# EasyEDA Pro project ProProject_FPGA_oscilloscope Analog pre circuit PCB_2024-05-13.epro, schematic Schematic3
Create Date: 2024-05-12; Page Name: P1; Project Name: FPGA_oscilloscope Analog pre circuit PCB; Schematic Name: Schematic3; Update Date: 2024-05-13; Company: 嘉立创EDA; Page Size: A4; Version: V1.0
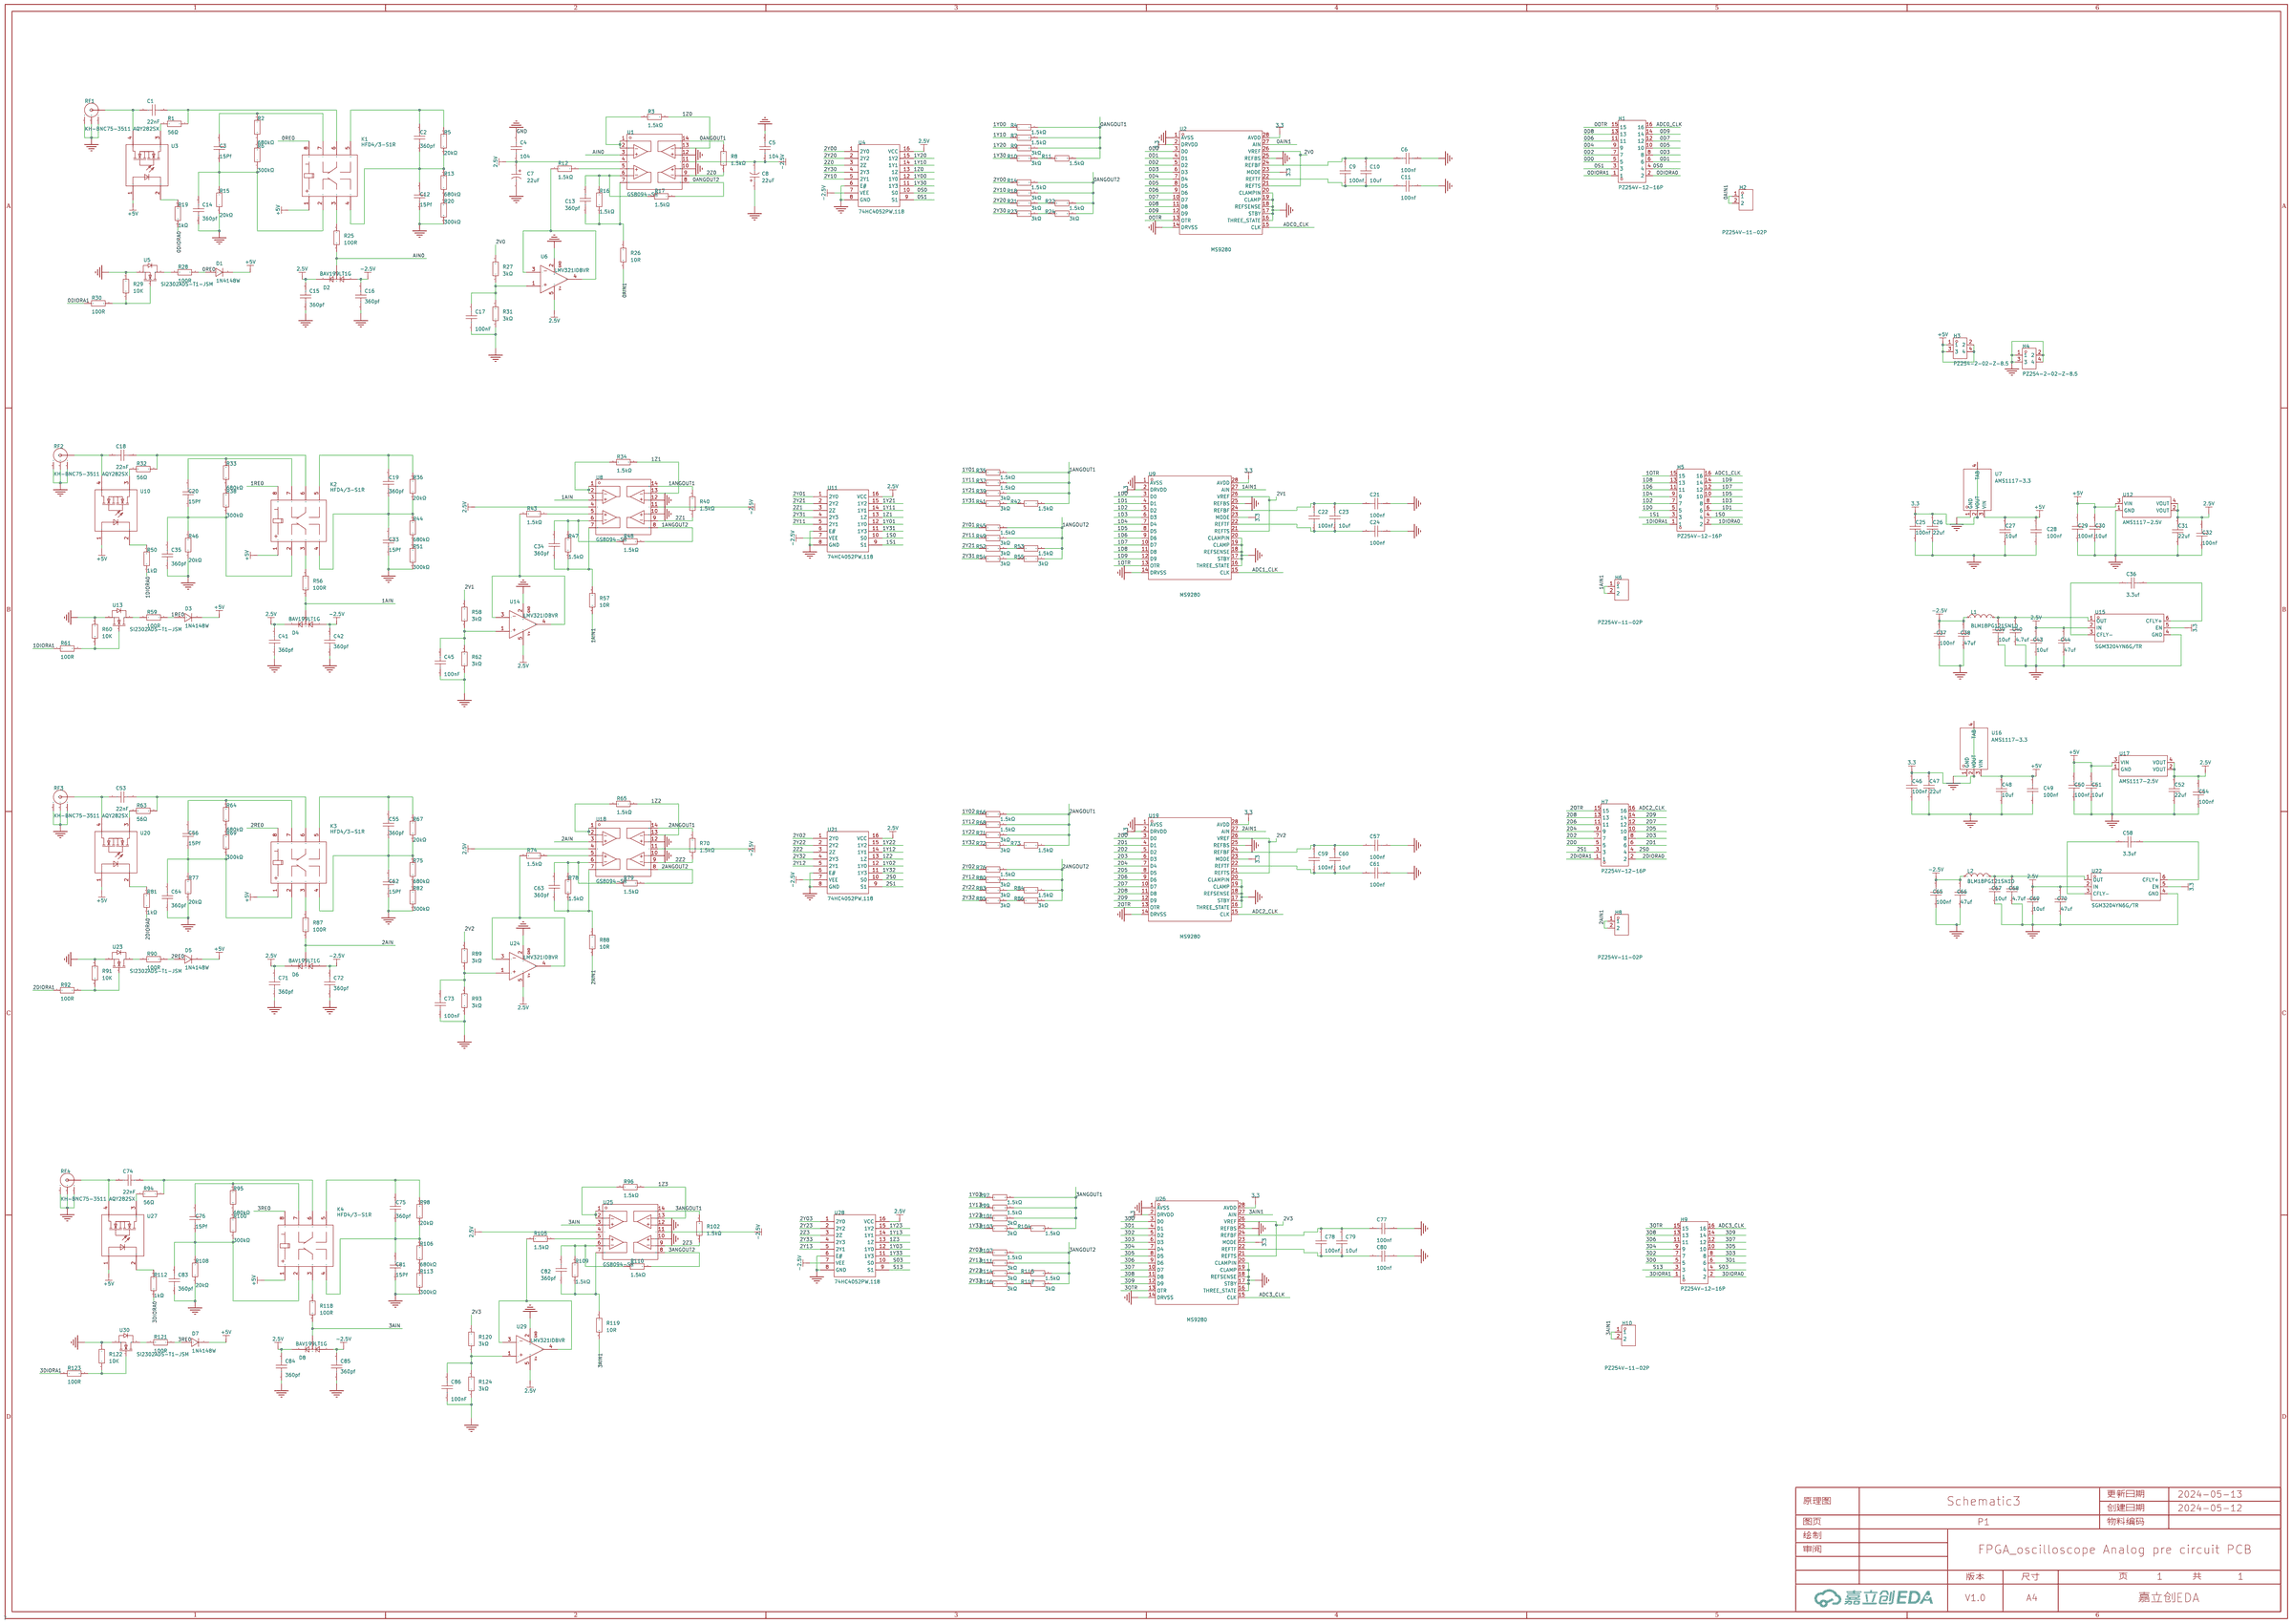
[diagram p0: schematic sheet]

## Parts
C1  22nF  [C0603]
C2  360pf  [C0603]
C3  15Pf  [C0603]
C4  104  [C0603]
C5  104  [C0603]
C6  100nf  [C0603]
C7  22uF  [CAP-SMD_BD4.0-L4.3-W4.3-FD-A]
C8  22uF  [CAP-SMD_BD4.0-L4.3-W4.3-FD-A]
C9  100nf  [C0603]
C10  10uf  [C0603]
C11  100nf  [C0603]
C12  15Pf  [C0603]
C13  360pf  [C0603]
C14  360pf  [C0603]
C15  360pf  [C0603]
C16  360pf  [C0603]
C17  100nF  [C0603]
C18  22nF  [C0603]
C19  360pf  [C0603]
C20  15Pf  [C0603]
C21  100nf  [C0603]
C22  100nf  [C0603]
C23  10uf  [C0603]
C24  100nf  [C0603]
C25  100nf  [C0603]
C26  22uf  [C0603]
C27  10uf  [C0603]
C28  100nf  [C0603]
C29  100nf  [C0603]
C30  10uf  [C0603]
C31  22uf  [C0603]
C32  100nf  [C0603]
C33  15Pf  [C0603]
C34  360pf  [C0603]
C35  360pf  [C0603]
C36  3.3uf  [C0603]
C37  100nf  [C0603]
C38  47uf  [C0603]
C39  10uf  [C0603]
C40  4.7uf  [C0603]
C41  360pf  [C0603]
C42  360pf  [C0603]
C43  10uf  [C0603]
C44  47uf  [C0603]
C45  100nF  [C0603]
C46  100nf  [C0603]
C47  22uf  [C0603]
C48  10uf  [C0603]
C49  100nf  [C0603]
C50  100nf  [C0603]
C51  10uf  [C0603]
C52  22uf  [C0603]
C53  22nF  [C0603]
C54  100nf  [C0603]
C55  360pf  [C0603]
C56  15Pf  [C0603]
C57  100nf  [C0603]
C58  3.3uf  [C0603]
C59  100nf  [C0603]
C60  10uf  [C0603]
C61  100nf  [C0603]
C62  15Pf  [C0603]
C63  360pf  [C0603]
C64  360pf  [C0603]
C65  100nf  [C0603]
C66  47uf  [C0603]
C67  10uf  [C0603]
C68  4.7uf  [C0603]
C69  10uf  [C0603]
C70  47uf  [C0603]
C71  360pf  [C0603]
C72  360pf  [C0603]
C73  100nF  [C0603]
C74  22nF  [C0603]
C75  360pf  [C0603]
C76  15Pf  [C0603]
C77  100nf  [C0603]
C78  100nf  [C0603]
C79  10uf  [C0603]
C80  100nf  [C0603]
C81  15Pf  [C0603]
C82  360pf  [C0603]
C83  360pf  [C0603]
C84  360pf  [C0603]
C85  360pf  [C0603]
C86  100nF  [C0603]
D1  1N4148W  [SOD-123_L2.8-W1.8-LS3.7-RD]
D2  BAV199LT1G  [SOT-23_L2.9-W1.3-P1.90-LS2.4-BR]
D3  1N4148W  [SOD-123_L2.8-W1.8-LS3.7-RD]
D4  BAV199LT1G  [SOT-23_L2.9-W1.3-P1.90-LS2.4-BR]
D5  1N4148W  [SOD-123_L2.8-W1.8-LS3.7-RD]
D6  BAV199LT1G  [SOT-23_L2.9-W1.3-P1.90-LS2.4-BR]
D7  1N4148W  [SOD-123_L2.8-W1.8-LS3.7-RD]
D8  BAV199LT1G  [SOT-23_L2.9-W1.3-P1.90-LS2.4-BR]
H1  PZ254V-12-16P  [HDR-TH_16P-P2.54-V-M-R2-C8-S2.54]
H2  PZ254V-11-02P  [HDR-TH_2P-P2.54-V-M]
H3  PZ254-2-02-Z-8.5  [HDR-TH_4P-P2.54-V-M-R2-C2-S2.54]
H4  PZ254-2-02-Z-8.5  [HDR-TH_4P-P2.54-V-M-R2-C2-S2.54]
H5  PZ254V-12-16P  [HDR-TH_16P-P2.54-V-M-R2-C8-S2.54]
H6  PZ254V-11-02P  [HDR-TH_2P-P2.54-V-M]
H7  PZ254V-12-16P  [HDR-TH_16P-P2.54-V-M-R2-C8-S2.54]
H8  PZ254V-11-02P  [HDR-TH_2P-P2.54-V-M]
H9  PZ254V-12-16P  [HDR-TH_16P-P2.54-V-M-R2-C8-S2.54]
H10  PZ254V-11-02P  [HDR-TH_2P-P2.54-V-M]
K1  HFD4/3-S1R  [RELAY-SMD_HFD4-3-S1R]
K2  HFD4/3-S1R  [RELAY-SMD_HFD4-3-S1R]
K3  HFD4/3-S1R  [RELAY-SMD_HFD4-3-S1R]
K4  HFD4/3-S1R  [RELAY-SMD_HFD4-3-S1R]
L1  BLM18PG121SN1D  [L0603]
L2  BLM18PG121SN1D  [L0603]
R1  56Ω  [R0603]
R2  680kΩ  [R0603]
R3  1.5kΩ  [R0603]
R4  1.5kΩ  [R0603]
R5  20kΩ  [R0603]
R6  300kΩ  [R0603]
R7  1.5kΩ  [R0603]
R8  1.5kΩ  [R0603]
R9  3kΩ  [R0603]
R10  3kΩ  [R0603]
R11  1.5kΩ  [R0603]
R12  1.5kΩ  [R0603]
R13  680kΩ  [R0603]
R14  1.5kΩ  [R0603]
R15  20kΩ  [R0603]
R16  1.5kΩ  [R0603]
R17  1.5kΩ  [R0603]
R18  3kΩ  [R0603]
R19  1kΩ  [R0603]
R20  300kΩ  [R0603]
R21  3kΩ  [R0603]
R22  1.5kΩ  [R0603]
R23  3kΩ  [R0603]
R24  3kΩ  [R0603]
R25  100R  [R0603]
R26  10R  [R0603]
R27  3kΩ  [R0603]
R28  100R  [R0603]
R29  10K  [R0603]
R30  100R  [R0603]
R31  3kΩ  [R0603]
R32  56Ω  [R0603]
R33  680kΩ  [R0603]
R34  1.5kΩ  [R0603]
R35  1.5kΩ  [R0603]
R36  20kΩ  [R0603]
R37  1.5kΩ  [R0603]
R38  300kΩ  [R0603]
R39  3kΩ  [R0603]
R40  1.5kΩ  [R0603]
R41  3kΩ  [R0603]
R42  1.5kΩ  [R0603]
R43  1.5kΩ  [R0603]
R44  680kΩ  [R0603]
R45  1.5kΩ  [R0603]
R46  20kΩ  [R0603]
R47  1.5kΩ  [R0603]
R48  1.5kΩ  [R0603]
R49  3kΩ  [R0603]
R50  1kΩ  [R0603]
R51  300kΩ  [R0603]
R52  3kΩ  [R0603]
R53  1.5kΩ  [R0603]
R54  3kΩ  [R0603]
R55  3kΩ  [R0603]
R56  100R  [R0603]
R57  10R  [R0603]
R58  3kΩ  [R0603]
R59  100R  [R0603]
R60  10K  [R0603]
R61  100R  [R0603]
R62  3kΩ  [R0603]
R63  56Ω  [R0603]
R64  680kΩ  [R0603]
R65  1.5kΩ  [R0603]
R66  1.5kΩ  [R0603]
R67  20kΩ  [R0603]
R68  1.5kΩ  [R0603]
R69  300kΩ  [R0603]
R70  1.5kΩ  [R0603]
R71  3kΩ  [R0603]
R72  3kΩ  [R0603]
R73  1.5kΩ  [R0603]
R74  1.5kΩ  [R0603]
R75  680kΩ  [R0603]
R76  1.5kΩ  [R0603]
R77  20kΩ  [R0603]
R78  1.5kΩ  [R0603]
R79  1.5kΩ  [R0603]
R80  3kΩ  [R0603]
R81  1kΩ  [R0603]
R82  300kΩ  [R0603]
R83  3kΩ  [R0603]
R84  1.5kΩ  [R0603]
R85  3kΩ  [R0603]
R86  3kΩ  [R0603]
R87  100R  [R0603]
R88  10R  [R0603]
R89  3kΩ  [R0603]
R90  100R  [R0603]
R91  10K  [R0603]
R92  100R  [R0603]
R93  3kΩ  [R0603]
R94  56Ω  [R0603]
R95  680kΩ  [R0603]
R96  1.5kΩ  [R0603]
R97  1.5kΩ  [R0603]
R98  20kΩ  [R0603]
R99  1.5kΩ  [R0603]
R100  300kΩ  [R0603]
R101  3kΩ  [R0603]
R102  1.5kΩ  [R0603]
R103  3kΩ  [R0603]
R104  1.5kΩ  [R0603]
R105  1.5kΩ  [R0603]
R106  680kΩ  [R0603]
R107  1.5kΩ  [R0603]
R108  20kΩ  [R0603]
R109  1.5kΩ  [R0603]
R110  1.5kΩ  [R0603]
R111  3kΩ  [R0603]
R112  1kΩ  [R0603]
R113  300kΩ  [R0603]
R114  3kΩ  [R0603]
R115  1.5kΩ  [R0603]
R116  3kΩ  [R0603]
R117  3kΩ  [R0603]
R118  100R  [R0603]
R119  10R  [R0603]
R120  3kΩ  [R0603]
R121  100R  [R0603]
R122  10K  [R0603]
R123  100R  [R0603]
R124  3kΩ  [R0603]
RF1  KH-BNC75-3511  [ANT-TH_KH-BNC75-3511]
RF2  KH-BNC75-3511  [ANT-TH_KH-BNC75-3511]
RF3  KH-BNC75-3511  [ANT-TH_KH-BNC75-3511]
RF4  KH-BNC75-3511  [ANT-TH_KH-BNC75-3511]
U1  GS8094-SR  [SOIC-14_L8.7-W3.9-P1.27-LS6.0-BL]
U2  MS9280  [SSOP-28_L10.2-W5.3-P0.65-LS7.8-BL]
U3  AQY282SX  [SOP-4_L4.3-W4.4-P2.54-LS7.0-BL]
U4  74HC4052PW,118  [TSSOP-16_L5.0-W4.4-P0.65-LS6.4-BL]
U5  SI2302ADS-T1-JSM  [SOT-23-3_L2.9-W1.3-P1.90-LS2.4-BR]
U6  LMV321IDBVR  [SOT-23-5_L3.0-W1.7-P0.95-LS2.8-BR]
U7  AMS1117-3.3  [SOT-223-3_L6.5-W3.5-P3.05-LS7.0]
U8  GS8094-SR  [SOIC-14_L8.7-W3.9-P1.27-LS6.0-BL]
U9  MS9280  [SSOP-28_L10.2-W5.3-P0.65-LS7.8-BL]
U10  AQY282SX  [SOP-4_L4.3-W4.4-P2.54-LS7.0-BL]
U11  74HC4052PW,118  [TSSOP-16_L5.0-W4.4-P0.65-LS6.4-BL]
U12  AMS1117-2.5V  [SOT-223_L6.5-W3.5-P2.30-LS7.0-BR]
U13  SI2302ADS-T1-JSM  [SOT-23-3_L2.9-W1.3-P1.90-LS2.4-BR]
U14  LMV321IDBVR  [SOT-23-5_L3.0-W1.7-P0.95-LS2.8-BR]
U15  SGM3204YN6G/TR  [SOT-23-6_L2.9-W1.6-P0.95-LS2.8-BR]
U16  AMS1117-3.3  [SOT-223-3_L6.5-W3.5-P3.05-LS7.0]
U17  AMS1117-2.5V  [SOT-223_L6.5-W3.5-P2.30-LS7.0-BR]
U18  GS8094-SR  [SOIC-14_L8.7-W3.9-P1.27-LS6.0-BL]
U19  MS9280  [SSOP-28_L10.2-W5.3-P0.65-LS7.8-BL]
U20  AQY282SX  [SOP-4_L4.3-W4.4-P2.54-LS7.0-BL]
U21  74HC4052PW,118  [TSSOP-16_L5.0-W4.4-P0.65-LS6.4-BL]
U22  SGM3204YN6G/TR  [SOT-23-6_L2.9-W1.6-P0.95-LS2.8-BR]
U23  SI2302ADS-T1-JSM  [SOT-23-3_L2.9-W1.3-P1.90-LS2.4-BR]
U24  LMV321IDBVR  [SOT-23-5_L3.0-W1.7-P0.95-LS2.8-BR]
U25  GS8094-SR  [SOIC-14_L8.7-W3.9-P1.27-LS6.0-BL]
U26  MS9280  [SSOP-28_L10.2-W5.3-P0.65-LS7.8-BL]
U27  AQY282SX  [SOP-4_L4.3-W4.4-P2.54-LS7.0-BL]
U28  74HC4052PW,118  [TSSOP-16_L5.0-W4.4-P0.65-LS6.4-BL]
U29  LMV321IDBVR  [SOT-23-5_L3.0-W1.7-P0.95-LS2.8-BR]
U30  SI2302ADS-T1-JSM  [SOT-23-3_L2.9-W1.3-P1.90-LS2.4-BR]

## Library data of the parts
C1-C6 C9-C86 = CC0603KRX7R9BB104: 容值:100nF;精度:±10%;额定电压:50V;材质(温度系数):X7R;; LCSC Part Name: 100nF ±10% 50V; Supplier Part: C14663; Manufacturer: YAGEO(国巨); Supplier Footprint: 0603; JLCPCB Part Class: 基础库; Datasheet: https://atta.szlcsc.com/upload/public/pdf/source/20180910/C282072_33301C7F631E79921B82A8DAC6BCC5B3.pdf; Supplier: LCSC; Tolerance: ±10%; Voltage Rated: 50V; Temperature Coefficient: X7R
C7 C8 = RVT22UF16V67RV0017: 容值:22uF;精度:±20%;额定电压:16V;纹波电流:21mA@120Hz;等效串联电阻:-;; LCSC Part Name: 22uF ±20% 16V; Supplier Part: C2895280; Manufacturer: KNSCHA(科尼盛); Supplier Footprint: SMD,D4xL5.4mm; JLCPCB Part Class: 扩展库; Datasheet: https://atta.szlcsc.com/upload/public/pdf/source/20210913/F3045483CFF837C1D63EB135475AA9CE.pdf; Supplier: LCSC; Tolerance: ±20%; Rated Voltage: 16V; Ripple Current: 21mA@120Hz; φD: 4mm; L: 5.4mm; Lifetime @ Temp: 2000hrs@105℃; Operating Temperature: -55℃~+105℃
D1 D3 D5 D7 = 1N4148W_C2099: 二极管配置:独立式;正向压降(Vf):1.25V@150mA;直流反向耐压(Vr):100V;平均整流电流(Io):150mA;功率:500mW;反向恢复时间(trr):4ns;; LCSC Part Name: 电压:100V 电流:150mA; Supplier Part: C2099; Manufacturer: CJ(江苏长电/长晶); Supplier Footprint: SOD-123; JLCPCB Part Class: 扩展库; Datasheet: https://atta.szlcsc.com/upload/public/pdf/source/20120428/1457706480199.pdf; Supplier: LCSC; Diode Configuration: 独立式; Forward Voltage (Vf@If): 1.25V@150mA; Reverse Voltage (Vr): 100V; Average Rectified Current (Io): 150mA; Power Dissipation: 500mW; Reverse Leakage Current: 1uA@75V; Reverse Recovery Time (trr): 4ns
D2 D4 D6 D8 = BAV199LT1G: 二极管配置:1对串联式;正向压降(Vf):1.25V@150mA;直流反向耐压(Vr):70V;平均整流电流(Io):215mA;; LCSC Part Name: 电压:70V 电流:215mA; Supplier Part: C145516; Manufacturer: onsemi(安森美); Supplier Footprint: SOT-23; JLCPCB Part Class: 扩展库; Datasheet: https://atta.szlcsc.com/upload/public/pdf/source/20180112/C145516_15157255405661261285.PDF; Supplier: LCSC; Diode Configuration: 1对串联式; Forward Voltage (Vf@If): 1.25V@150mA; Reverse Voltage (Vr): 70V; Average Rectified Current (Io): 215mA; Reverse Leakage Current: 5uA@70V
H1 H5 H7 H9 = PZ254V-12-16P: 插针结构:2x8P;间距:2.54mm;行距:2.54mm;圆针/方针:方针;安装类型:直插;排数:双排;总PIN位数:16P;额定电流:-;额定电压:-;配合针长度:6mm;塑高:2.5mm;端接针长度:3mm;触头材质:黄铜;触头镀层:-;工作温度范围:-40℃~+105℃;颜色:黑色;; LCSC Part Name: 间距:2.54mm 2x8P 直插 方针; Supplier Part: C492425; Manufacturer: XFCN(兴飞); Supplier Footprint: 插件,P=2.54mm; JLCPCB Part Class: 扩展库; Datasheet: https://atta.szlcsc.com/upload/public/pdf/source/20200309/C492425_0A00EE06259AD0A0AB9C88167BB69964.pdf; Supplier: LCSC; Pin Structure: 2x8P; Pitch: 2.54mm; Row Spacing: 2.54mm; Circluar Pins/Square Pins: 方针; Mounting Type: 直插; Number of Rows: 双排; Number of Pins: 16P; Length of Mating Pin: 6mm; Insulation Height: 2.5mm; Length of End Connection Pin: 3mm; Contact Material: 黄铜; Operating Temperature Range: -40℃~+105℃; Color: 黑色
H2 H6 H8 H10 = PZ254V-11-02P: 插针结构:1x2P;间距:2.54mm;行距:-;圆针/方针:方针;安装类型:直插;排数:单排;总PIN位数:2P;额定电流:-;额定电压:-;配合针长度:6mm;塑高:2.5mm;端接针长度:3mm;触头材质:黄铜;触头镀层:-;工作温度范围:-40℃~+105℃;颜色:黑色;; LCSC Part Name: 间距:2.54mm 1x2P 直插 方针; Supplier Part: C492401; Manufacturer: XFCN(兴飞); Supplier Footprint: 插件,P=2.54mm; JLCPCB Part Class: 扩展库; Datasheet: https://atta.szlcsc.com/upload/public/pdf/source/20200309/C492401_A812433581A9B211A7FFA413ADDFF0E5.pdf; Supplier: LCSC; Pin Structure: 1x2P; Pitch: 2.54mm; Circluar Pins/Square Pins: 方针; Mounting Type: 直插; Number of Rows: 单排; Number of Pins: 2P; Length of Mating Pin: 6mm; Insulation Height: 2.5mm; Length of End Connection Pin: 3mm; Contact Material: 黄铜; Operating Temperature Range: -40℃~+105℃; Color: 黑色
H3 H4 = PZ254-2-02-Z-8.5_C2894963: 插针结构:2x2P;间距:2.54mm;行距:2.54mm;圆针/方针:方针;安装类型:直插;排数:双排;总PIN位数:4P;额定电流:3A;额定电压:-;配合针长度:6mm;塑高:2.5mm;端接针长度:3mm;触头材质:黄铜;工作温度范围:-40℃~+105℃;焊接温度(最大值):260℃@10S;颜色:黑色;; LCSC Part Name: 2x2P 间距:2.54mm 方针 直插; Supplier Part: C2894963; Manufacturer: HCTL(华灿天禄); Supplier Footprint: 插件,P=2.54mm; JLCPCB Part Class: 扩展库; Datasheet: https://atta.szlcsc.com/upload/public/pdf/source/20230609/5BA09C8BEB9B31376F8BF6032FF67CAC.pdf; Supplier: LCSC; Pin Structure: 2x2P; Pitch: 2.54mm; Row Spacing: 2.54mm; Circluar Pins/Square Pins: 方针; Mounting Type: 直插; Number of Rows: 双排; Number of Pins: 4P; Current Rating (Max): 3A; Length of Mating Pin: 6mm; Insulation Height: 2.5mm; Length of End Connection Pin: 3mm; Contact Material: 黄铜; Operating Temperature Range: -40℃~+105℃; Soldering Temperature(Max): 260℃@10S; Color: 黑色
K1-K4 = HFD4/3-S1R: 线圈电压:3V;触点形式:两组转换:2C(双刀双掷-转换);触点容量(电阻负载):1A@30VDC；300mA@125VAC;最大切换电压:250V@AC；220V@DC;最大切换电流:2A;; LCSC Part Name: 超小型3V继电器 双刀双掷; Supplier Part: C143232; Manufacturer: HF(宏发); Supplier Footprint: SMD,6.5x10mm; JLCPCB Part Class: 扩展库; Supplier: LCSC; Coil Voltage: 3V; Contact Form: 两组转换:2C(双刀双掷-转换); Pin Number: 8; Contact Rating: 1A@30VDC；300mA@125VAC; Maximum Switching Voltage: 250V@AC；220V@DC; Contact Material: AgNi+镀金; Coil Rated Power: 140mW; Coil Resistance: 64.3Ω; Maximum Switching Current: 2A; Operate Time: 3ms; Release Time: 3ms; Coil Type: 有极性-单线圈; Contact Resistance: 100mΩ; Operating Temperature: -40℃~+85℃
L1 L2 = BLM18PG121SN1D: 标称阻抗@测试频率:120Ω@100MHz;误差:±25%;直流电阻(RDC):50mΩ;; LCSC Part Name: 单路 0603磁珠 阻抗120Ω@100MHz; Supplier Part: C14709; Manufacturer: muRata(村田); Supplier Footprint: 0603; JLCPCB Part Class: 扩展库; Datasheet: https://atta.szlcsc.com/upload/public/pdf/source/20130704/1457706621422.pdf; Supplier: LCSC; Impedance @ Frequency: 120Ω@100MHz; Tolerance: ±25%; DC Resistance: 50mΩ; Current Rating: 2A; Circuits: 1
R1-R124 = 0603WAF1001T5E: 电阻类型:厚膜电阻;阻值:1kΩ;精度:±1%;功率:100mW;最大工作电压:75V;温度系数:±100ppm/℃;; LCSC Part Name: 1kΩ ±1% 100mW 厚膜电阻; Supplier Part: C21190; Manufacturer: UNI-ROYAL(厚声); Supplier Footprint: 0603; JLCPCB Part Class: 基础库; Datasheet: https://atta.szlcsc.com/upload/public/pdf/source/20200306/C422600_1E6D84923E4A46A82E41ADD87F860B5C.pdf; Supplier: LCSC; Type: 厚膜电阻; Tolerance: ±1%; Power(Watts): 100mW; Overload Voltage (Max): 75V; Temperature Coefficient: ±100ppm/℃; Operating Temperature Range: -55℃~+155℃
RF1-RF4 = KH-BNC75-3511: 连接器类型:板端;接口类型:内孔;端口数量:1;接口直径:9.5mm;接口长度/高度:-;频率-最大值:3GHz;射频系列:BNC;阻抗:75Ω;样式:弯头;工作温度范围:-55℃~+155℃;; LCSC Part Name: BNC 内孔 弯头; Supplier Part: C2837588; Manufacturer: kinghelm(金航标); Supplier Footprint: 插件; JLCPCB Part Class: 扩展库; Datasheet: https://atta.szlcsc.com/upload/public/pdf/source/20221123/107886A8942993FCB0C00E519661A2AA.pdf; Supplier: LCSC; Connector Type: 板端; Interface Type: 内孔; Number of Ports: 1; Interface Diameter: 9.5mm; Frequency-Max: 3GHz; RF Series: BNC; Impedance: 75Ω; Style: 弯头; Operating Temperature Range: -55℃~+155℃
U1 U8 U18 U25 = GS8094-SR: 放大器数:四路;增益带宽积(GBP):180MHz;输入偏置电流(Ib):1pA;输入失调电压(Vos):2mV;带宽(-3db):180MHz;; Supplier Part: C157726; Manufacturer: Gainsil(聚洵); Supplier Footprint: SOIC-14; JLCPCB Part Class: 扩展库; Datasheet: https://atta.szlcsc.com/upload/public/pdf/source/20220610/E3748DDE2830B859623FB1BDA24ABCCF.pdf; Supplier: LCSC; Number of Circuits: 四路; Gain Bandwidth Product(GBP): 180MHz; Current - Input Bias(Ib): 1pA; Voltage - Input Offset(Vos): 2mV; -3db Bandwidth: 180MHz; Supply Current: 4.2mA
U2 U9 U19 U26 = MS9280: 接口:并行;电源电压:2.7V~5.5V;采样率:35MHz;分辨率:10位;; LCSC Part Name: 1通道 50MHz 10位ADC 并行接口; Supplier Part: C1509021; Manufacturer: 杭州瑞盟; Supplier Footprint: SSOP-28-208mil; JLCPCB Part Class: 扩展库; Datasheet: https://atta.szlcsc.com/upload/public/pdf/source/20231007/DECFDB597B151F846156A5BCFBCA36B2.pdf; Supplier: LCSC; Interface: 并行; number of channels: 1; Supply Voltage: 2.7V~5.5V; sampling frequency: 35MHz; resolution: 10位
U3 U10 U20 U27 = AQY282SX: 继电器触点形式:1 Form A(SPST-NO);适用负载类型:AC,DC;正向压降:1.14V;负载电压:60V;连续负载电流:500mA;导通电阻:850mΩ;; LCSC Part Name: 1 Form A(SPSTNO) 负载AC,DC 负载电压60V; Supplier Part: C250827; Manufacturer: PANASONIC(松下); Supplier Footprint: SOP-4-2.54mm; JLCPCB Part Class: 扩展库; Datasheet: https://atta.szlcsc.com/upload/public/pdf/source/20191104/C443818_6B9110F31C59FBA60B0CFD8E57AA94AC.pdf; Supplier: LCSC; Relay Contact Form: 1 Form A(SPST-NO); Load Type: AC,DC; Input Forward Voltage: 1.14V; Voltage - Load: 60V; Continuous Load Current: 500mA; On Resistance: 850mΩ; Isolation Voltage(rms): 1.5kV; Turn-on time: 900us; Turn-off time: 500us
U4 U11 U21 U28 = 74HC4052PW,118: 开关电路:单刀四掷(SP4T);通道数:2;导通电阻(Ron@VCC):150Ω;; Supplier Part: C5646; Manufacturer: Nexperia(安世); Supplier Footprint: TSSOP-16; JLCPCB Part Class: 扩展库; Datasheet: https://atta.szlcsc.com/upload/public/pdf/source/20130225/1457706594415.pdf; Supplier: LCSC; Switch Circuit: 单刀四掷(SP4T); Number of Channels: 2; Supply Voltage: 2V~10V; Turn-on time: 58ns; On-State Resistance (Max): 150Ω; Turn-off time: 48ns
U5 U13 U23 U30 = SI2302ADS-T1-JSM: Supplier Part: C6533558; Manufacturer: JSMSEMI(杰盛微); Supplier Footprint: SOT-23-3; JLCPCB Part Class: 扩展库; Datasheet: https://atta.szlcsc.com/upload/public/pdf/source/20230612/FFE5D426B922876E1ACE369FE8401F3F.pdf; Supplier: LCSC
U6 U14 U24 U29 = LMV321IDBVR_C7972: 放大器数:单路;增益带宽积(GBP):1MHz;输入偏置电流(Ib):15nA;压摆率(SR):1V/us;带宽(-3db):-;轨到轨:-;; Supplier Part: C7972; Manufacturer: TI(德州仪器); Supplier Footprint: SOT-23-5; JLCPCB Part Class: 扩展库; Datasheet: https://www.ti.com/cn/lit/gpn/lmv321; Supplier: LCSC; Number of Circuits: 单路; Gain Bandwidth Product(GBP): 1MHz; Current - Input Bias(Ib): 15nA; Slew Rate(SR): 1V/us; Output Current: 160mA; Supply Current: 130uA; Operating Temperature: -40℃~+125℃
U7 U16 = AMS1117-3.3_C5250992: 输出类型：固定 输出极性：正 最大输入电压：18V 输出电压：3.3V 输出电流：1A 电源纹波抑制比(PSRR)：60dB@(120Hz)。当前应用较多领域：三端稳压器，机顶盒; Supplier Part: C5250992; Manufacturer: TWGMC(台湾迪嘉); Supplier Footprint: SOT-223-3L; JLCPCB Part Class: 扩展库; Datasheet: https://atta.szlcsc.com/upload/public/pdf/source/20221109/A58A92B07670E85D28928AE371260E8D.pdf; Supplier: LCSC
U12 U17 = AMS1117-2.5V_1: 输出类型:固定;最大输入电压:18V;输出电压:2.5V;最大输出电流:1A;电源纹波抑制比(PSRR):60dB@(120Hz);输出极性:正极;; LCSC Part Name: 正 Vin=18V Vout=2.5V 1A 60dB@(120Hz); Supplier Part: C5240656; Manufacturer: MSKSEMI(美森科); Supplier Footprint: SOT-223; JLCPCB Part Class: 扩展库; Datasheet: https://atta.szlcsc.com/upload/public/pdf/source/20230802/7000FCAFF33971783A269E7BD69EFE08.pdf; Supplier: LCSC; Output Type: 固定; Maximum Input Voltage: 18V; Output Voltage: 2.5V; MAX Output Current: 1A; Power Supply Rejection Ratio (PSRR): 60dB@(120Hz); Dropout Voltage: 1.3V@(1A); Output Polarity: 正极
U15 U22 = SGM3204YN6G/TR: 功能类型:-;输入电压:1.4V~5.5V;输出电压:-5.5V~-1.4V;输出电流(最大值):200mA;; Supplier Part: C194031; Manufacturer: SGMICRO(圣邦微); Supplier Footprint: SOT-23-6; JLCPCB Part Class: 扩展库; Datasheet: https://atta.szlcsc.com/upload/public/pdf/source/20180627/C194031_755051E53122D645C36CF727711B963E.pdf; Supplier: LCSC; Input Voltage: 1.4V~5.5V; Output Voltage: -5.5V~-1.4V; Output Current (Max): 200mA; Switching Frequency: 950kHz; Number of Outputs: 1; Switch tube (built-in/external): 内置

## Nets
2.5V: C4.1 C7.1 C15.2 C31.1 C32.1 C41.2 C43.1 C44.1 C52.1 C54.1 C69.1 C70.1 C71.2 C84.2 D2.2(C) D4.2(C) D6.2(C) D8.2(C) U1.4(V+) U4.16(VCC) U6.5(V+) U8.4(V+) U11.16(VCC) U12.2(VOUT) U12.4(VOUT) U14.5(V+) U15.2(IN) U17.2(VOUT) U17.4(VOUT) U18.4(V+) U21.16(VCC) U22.2(IN) U24.5(V+) U25.4(V+) U28.16(VCC) U29.5(V+)
2V0: R27.2 U2.21(REFTS) U2.26(VREF)
2V1: R58.2 U9.21(REFTS) U9.26(VREF)
2V2: R89.2 U19.21(REFTS) U19.26(VREF)
2V3: R120.2 U26.21(REFTS) U26.26(VREF)
+5V: C27.1 C28.1 C29.1 C30.1 C48.1 C49.1 C50.1 C51.1 D1.1(K) D3.1(K) D5.1(K) D7.1(K) H3.1 H3.2 H3.3 H3.4 K1.1 K2.1 K3.1 K4.1 U3.1 U7.3(VIN) U10.1 U12.3(VIN) U16.3(VIN) U17.3(VIN) U20.1 U27.1
-2.5V: C5.1 C8.2 C16.2 C37.1 C38.1 C42.2 C65.1 C66.1 C72.2 C85.2 D2.1(A) D4.1(A) D6.1(A) D8.1(A) L1.1 L2.1 U1.11(V-) U4.7(VEE) U8.11(V-) U11.7(VEE) U18.11(V-) U21.7(VEE) U25.11(V-) U28.7(VEE)
GND: C4.2 C5.2 C6.1 C7.2 C8.1 C11.1 C12.1 C14.1 C15.1 C16.1 C17.1 C21.1 C24.1 C25.2 C26.2 C27.2 C28.2 C29.2 C30.2 C31.2 C32.2 C33.1 C35.1 C37.2 C38.2 C39.2 C40.2 C41.1 C42.1 C43.2 C44.2 C45.1 C46.2 C47.2 C48.2 C49.2 C50.2 C51.2 C52.2 C54.2 C57.1 C61.1 C62.1 C64.1 C65.2 C66.2 C67.2 C68.2 C69.2 C70.2 C71.1 C72.1 C73.1 C77.1 C80.1 C81.1 C83.1 C84.1 C85.1 C86.1 H4.1 H4.2 H4.3 H4.4 R15.1 R20.1 R29.1 R31.1 R46.1 R51.1 R60.1 R62.1 R77.1 R82.1 R91.1 R93.1 R108.1 R113.1 R122.1 R124.1 RF1.2 RF1.3 RF1.4 RF2.2 RF2.3 RF2.4 RF3.2 RF3.3 RF3.4 RF4.2 RF4.3 RF4.4 U1.10(INC+) U1.12(IND+) U2.1(AVSS) U2.14(DRVSS) U2.16(THREE_STATE) U2.17(STBY) U2.18(REFSENSE) U2.19(CLAMP) U2.20(CLAMPIN) U2.25(REFBS) U4.6(E#) U4.8(GND) U5.2(S) U6.2(GND) U7.1(GND) U8.10(INC+) U8.12(IND+) U9.1(AVSS) U9.14(DRVSS) U9.16(THREE_STATE) U9.17(STBY) U9.18(REFSENSE) U9.19(CLAMP) U9.20(CLAMPIN) U9.25(REFBS) U11.6(E#) U11.8(GND) U12.1(GND) U13.2(S) U14.2(GND) U15.4(GND) U16.1(GND) U17.1(GND) U18.10(INC+) U18.12(IND+) U19.1(AVSS) U19.14(DRVSS) U19.16(THREE_STATE) U19.17(STBY) U19.18(REFSENSE) U19.19(CLAMP) U19.20(CLAMPIN) U19.25(REFBS) U21.6(E#) U21.8(GND) U22.4(GND) U23.2(S) U24.2(GND) U25.10(INC+) U25.12(IND+) U26.1(AVSS) U26.14(DRVSS) U26.16(THREE_STATE) U26.17(STBY) U26.18(REFSENSE) U26.19(CLAMP) U26.20(CLAMPIN) U26.25(REFBS) U28.6(E#) U28.8(GND) U29.2(GND) U30.2(S)
0AIN1: H2.1 H2.2 R26.2 U2.27(AIN)
0ANGOUT1: R4.2 R7.2 R8.2 R9.2 R11.2 U1.14(OUTD)
0ANGOUT2: R14.2 R17.1 R18.2 R22.2 R24.2 U1.8(OUTC)
0D0: H1.5 U2.3(D0)
0D1: H1.6 U2.4(D1)
0D2: H1.7 U2.5(D2)
0D3: H1.8 U2.6(D3)
0D4: H1.9 U2.7(D4)
0D5: H1.10 U2.8(D5)
0D6: H1.11 U2.9(D6)
0D7: H1.12 U2.10(D7)
0D8: H1.13 U2.11(D8)
0D9: H1.14 U2.12(D9)
0DIORA0: H1.2 R19.1
0DIORA1: H1.1 R30.1
0OTR: H1.15 U2.13(OTR)
0RE0: D1.2(A) K1.8 R28.1
0S0: H1.4 U4.10(S0)
0S1: H1.3 U4.9(S1)
1AIN: D4.3(C/A) R56.2 U8.3(INA+)
1AIN1: H6.1 H6.2 R57.2 U9.27(AIN)
1ANGOUT1: R35.2 R37.2 R39.2 R40.2 R42.2 U8.14(OUTD)
1ANGOUT2: R45.2 R48.1 R49.2 R53.2 R55.2 U8.8(OUTC)
1D0: H5.5 U9.3(D0)
1D1: H5.6 U9.4(D1)
1D2: H5.7 U9.5(D2)
1D3: H5.8 U9.6(D3)
1D4: H5.9 U9.7(D4)
1D5: H5.10 U9.8(D5)
1D6: H5.11 U9.9(D6)
1D7: H5.12 U9.10(D7)
1D8: H5.13 U9.11(D8)
1D9: H5.14 U9.12(D9)
1DIORA0: H5.2 R50.1
1DIORA1: H5.1 R61.1
1OTR: H5.15 U9.13(OTR)
1RE0: D3.2(A) K2.8 R59.1
1S0: H5.4 U11.10(S0)
1S1: H5.3 U11.9(S1)
1Y00: R4.1 U4.12(1Y0)
1Y01: R35.1 U11.12(1Y0)
1Y02: R66.1 U21.12(1Y0)
1Y03: R97.1 U28.12(1Y0)
1Y10: R7.1 U4.14(1Y1)
1Y11: R37.1 U11.14(1Y1)
1Y12: R68.1 U21.14(1Y1)
1Y13: R99.1 U28.14(1Y1)
1Y20: R9.1 U4.15(1Y2)
1Y21: R39.1 U11.15(1Y2)
1Y22: R71.1 U21.15(1Y2)
1Y23: R101.1 U28.15(1Y2)
1Y30: R10.1 U4.11(1Y3)
1Y31: R41.1 U11.11(1Y3)
1Y32: R72.1 U21.11(1Y3)
1Y33: R103.1 U28.11(1Y3)
1Z0: R3.1 U1.13(IND-) U4.13(1Z)
1Z1: R34.1 U8.13(IND-) U11.13(1Z)
1Z2: R65.1 U18.13(IND-) U21.13(1Z)
1Z3: R96.1 U25.13(IND-) U28.13(1Z)
2AIN: D6.3(C/A) R87.2 U18.3(INA+)
2AIN1: H8.1 H8.2 R88.2 U19.27(AIN)
2ANGOUT1: R66.2 R68.2 R70.2 R71.2 R73.2 U18.14(OUTD)
2ANGOUT2: R76.2 R79.1 R80.2 R84.2 R86.2 U18.8(OUTC)
2D0: H7.5 U19.3(D0)
2D1: H7.6 U19.4(D1)
2D2: H7.7 U19.5(D2)
2D3: H7.8 U19.6(D3)
2D4: H7.9 U19.7(D4)
2D5: H7.10 U19.8(D5)
2D6: H7.11 U19.9(D6)
2D7: H7.12 U19.10(D7)
2D8: H7.13 U19.11(D8)
2D9: H7.14 U19.12(D9)
2DIORA0: H7.2 R81.1
2DIORA1: H7.1 R92.1
2OTR: H7.15 U19.13(OTR)
2RE0: D5.2(A) K3.8 R90.1
2S0: H7.4 U21.10(S0)
2S1: H7.3 U21.9(S1)
2Y00: R14.1 U4.1(2Y0)
2Y01: R45.1 U11.1(2Y0)
2Y02: R76.1 U21.1(2Y0)
2Y03: R107.1 U28.1(2Y0)
2Y10: R18.1 U4.5(2Y1)
2Y11: R49.1 U11.5(2Y1)
2Y12: R80.1 U21.5(2Y1)
2Y13: R111.1 U28.5(2Y1)
2Y20: R21.1 U4.2(2Y2)
2Y21: R52.1 U11.2(2Y2)
2Y22: R83.1 U21.2(2Y2)
2Y23: R114.1 U28.2(2Y2)
2Y30: R23.1 U4.4(2Y3)
2Y31: R54.1 U11.4(2Y3)
2Y32: R85.1 U21.4(2Y3)
2Y33: R116.1 U28.4(2Y3)
2Z0: R8.1 U1.9(INC-) U4.3(2Z)
2Z1: R40.1 U8.9(INC-) U11.3(2Z)
2Z2: R70.1 U18.9(INC-) U21.3(2Z)
2Z3: R102.1 U25.9(INC-) U28.3(2Z)
3.3: C25.1 C26.1 C46.1 C47.1 U2.2(DRVDD) U2.23(MODE) U2.28(AVDD) U7.2(VOUT) U7.4(TAB) U9.2(DRVDD) U9.23(MODE) U9.28(AVDD) U15.5(EN) U16.2(VOUT) U16.4(TAB) U19.2(DRVDD) U19.23(MODE) U19.28(AVDD) U22.5(EN) U26.2(DRVDD) U26.23(MODE) U26.28(AVDD)
3AIN: D8.3(C/A) R118.2 U25.3(INA+)
3AIN1: H10.1 H10.2 R119.2 U26.27(AIN)
3ANGOUT1: R97.2 R99.2 R101.2 R102.2 R104.2 U25.14(OUTD)
3ANGOUT2: R107.2 R110.1 R111.2 R115.2 R117.2 U25.8(OUTC)
3D0: H9.5 U26.3(D0)
3D1: H9.6 U26.4(D1)
3D2: H9.7 U26.5(D2)
3D3: H9.8 U26.6(D3)
3D4: H9.9 U26.7(D4)
3D5: H9.10 U26.8(D5)
3D6: H9.11 U26.9(D6)
3D7: H9.12 U26.10(D7)
3D8: H9.13 U26.11(D8)
3D9: H9.14 U26.12(D9)
3DIORA0: H9.2 R112.1
3DIORA1: H9.1 R123.1
3OTR: H9.15 U26.13(OTR)
3RE0: D7.2(A) K4.8 R121.1
ADC0_CLK: H1.16 U2.15(CLK)
ADC1_CLK: H5.16 U9.15(CLK)
ADC2_CLK: H7.16 U19.15(CLK)
ADC3_CLK: H9.16 U26.15(CLK)
AIN0: D2.3(C/A) R25.2 U1.3(INA+)
S03: H9.4 U28.10(S0)
S13: H9.3 U28.9(S1)
$1N7577: C1.1 RF1.1(OUT) U3.4
$1N7578: R19.2 U3.2
$1N7582: R1.2 U3.3
$1N7586: C3.2 K1.7 R2.2
$1N7587: K1.3 R25.1
$1N7592: R29.2 R30.2 U5.1(G)
$1N7596: R28.2 U5.3(D)
$1N7605: C3.1 C14.2 K1.2 R6.1 R15.2
$1N7665: C39.1 C40.1 L1.2 U15.1(OUT)
$1N7669: C6.2 C9.2 C10.2 U2.24(REFBF)
$1N7671: C9.1 C10.1 C11.2 U2.22(REFTF)
$1N7673: C36.2 U15.6(CFLY+)
$1N7674: C36.1 U15.3(CFLY-)
$1N7676: C2.1 C12.2 K1.4 R5.1 R13.2
$1N7693: R3.2 U1.1(OUTA) U1.2(INA-)
$1N7724: R21.2 R22.1
$1N7725: R10.2 R11.1
$1N7730: R23.2 R24.1
$1N7731: R13.1 R20.2
$1N7732: R2.1 R6.2
$1N7733: C1.2 K1.6 R1.1
$1N7778: C17.2 R27.1 R31.2 U6.1(+)
$1N7779: R12.2 U6.3(-) U6.4(OUT)
$1N7780: C2.2 K1.5 R5.2
$1N7783: C13.1 R16.1 R26.1 U1.7(OUTB)
$1N7784: C13.2 R16.2 R17.2 U1.6(INB-)
$1N7785: R12.1 U1.5(INB+)
$1N14945: C18.1 RF2.1(OUT) U10.4
$1N14946: R50.2 U10.2
$1N14950: R32.2 U10.3
$1N14954: C20.2 K2.7 R33.2
$1N14955: K2.3 R56.1
$1N14958: R60.2 R61.2 U13.1(G)
$1N14962: R59.2 U13.3(D)
$1N14971: C20.1 C35.2 K2.2 R38.1 R46.2
$1N15015: C21.2 C22.2 C23.2 U9.24(REFBF)
$1N15017: C22.1 C23.1 C24.2 U9.22(REFTF)
$1N15019: C19.1 C33.2 K2.4 R36.1 R44.2
$1N15036: R34.2 U8.1(OUTA) U8.2(INA-)
$1N15067: R52.2 R53.1
$1N15068: R41.2 R42.1
$1N15073: R54.2 R55.1
$1N15074: R44.1 R51.2
$1N15075: R33.1 R38.2
$1N15076: C18.2 K2.6 R32.1
$1N15087: C45.2 R58.1 R62.2 U14.1(+)
$1N15088: R43.2 U14.3(-) U14.4(OUT)
$1N15089: C19.2 K2.5 R36.2
$1N15092: C34.1 R47.1 R57.1 U8.7(OUTB)
$1N15093: C34.2 R47.2 R48.2 U8.6(INB-)
$1N15094: R43.1 U8.5(INB+)
$1N24491: C53.1 RF3.1(OUT) U20.4
$1N24492: R81.2 U20.2
$1N24496: R63.2 U20.3
$1N24500: C56.2 K3.7 R64.2
$1N24501: K3.3 R87.1
$1N24504: R91.2 R92.2 U23.1(G)
$1N24508: R90.2 U23.3(D)
$1N24517: C56.1 C64.2 K3.2 R69.1 R77.2
$1N24561: C57.2 C59.2 C60.2 U19.24(REFBF)
$1N24563: C59.1 C60.1 C61.2 U19.22(REFTF)
$1N24565: C55.1 C62.2 K3.4 R67.1 R75.2
$1N24582: R65.2 U18.1(OUTA) U18.2(INA-)
$1N24613: R83.2 R84.1
$1N24614: R72.2 R73.1
$1N24619: R85.2 R86.1
$1N24620: R75.1 R82.2
$1N24621: R64.1 R69.2
$1N24622: C53.2 K3.6 R63.1
$1N24633: C73.2 R89.1 R93.2 U24.1(+)
$1N24634: R74.2 U24.3(-) U24.4(OUT)
$1N24635: C55.2 K3.5 R67.2
$1N24638: C63.1 R78.1 R88.1 U18.7(OUTB)
$1N24639: C63.2 R78.2 R79.2 U18.6(INB-)
$1N24640: R74.1 U18.5(INB+)
$1N27376: C74.1 RF4.1(OUT) U27.4
$1N27377: R112.2 U27.2
$1N27381: R94.2 U27.3
$1N27385: C76.2 K4.7 R95.2
$1N27386: K4.3 R118.1
$1N27389: R122.2 R123.2 U30.1(G)
$1N27393: R121.2 U30.3(D)
$1N27402: C76.1 C83.2 K4.2 R100.1 R108.2
$1N27446: C77.2 C78.2 C79.2 U26.24(REFBF)
$1N27448: C78.1 C79.1 C80.2 U26.22(REFTF)
$1N27450: C75.1 C81.2 K4.4 R98.1 R106.2
$1N27467: R96.2 U25.1(OUTA) U25.2(INA-)
$1N27498: R114.2 R115.1
$1N27499: R103.2 R104.1
$1N27504: R116.2 R117.1
$1N27505: R106.1 R113.2
$1N27506: R95.1 R100.2
$1N27507: C74.2 K4.6 R94.1
$1N27518: C86.2 R120.1 R124.2 U29.1(+)
$1N27519: R105.2 U29.3(-) U29.4(OUT)
$1N27520: C75.2 K4.5 R98.2
$1N27523: C82.1 R109.1 R119.1 U25.7(OUTB)
$1N27524: C82.2 R109.2 R110.2 U25.6(INB-)
$1N27525: R105.1 U25.5(INB+)
$1N28363: C67.1 C68.1 L2.2 U22.1(OUT)
$1N28367: C58.2 U22.6(CFLY+)
$1N28368: C58.1 U22.3(CFLY-)
